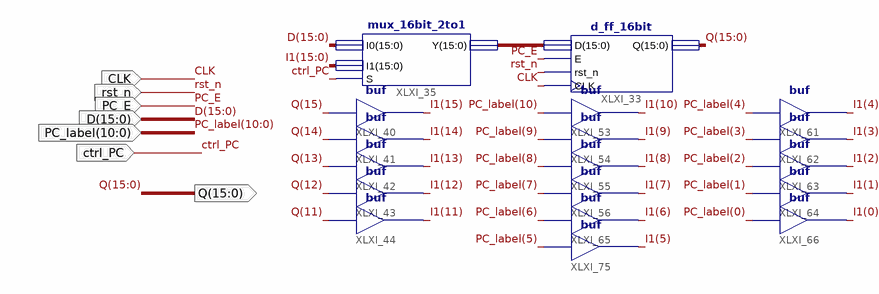
[diagram p0: schematic sheet 1]
// Xilinx ISE schematic PC_Circuit.sch (virtex6) as structural Verilog: 18 symbols, 7 ports
module PC_Circuit (
  input  rst_n,
  input  CLK,
  input  PC_E,
  input  [15:0] D,
  input  ctrl_PC,
  input  [10:0] PC_label,
  output [15:0] Q
);

  wire [15:0] I1, XLXN_159;

  mux_16bit_2to1 XLXI_35 (.S(ctrl_PC), .I1(I1), .I0(D), .Y(XLXN_159));
  d_ff_16bit XLXI_33 (.E(PC_E), .D(XLXN_159), .Q(Q), .CLK(CLK), .rst_n(rst_n));
  buf XLXI_40 (I1[15], Q[15]);
  buf XLXI_41 (I1[14], Q[14]);
  buf XLXI_42 (I1[13], Q[13]);
  buf XLXI_43 (I1[12], Q[12]);
  buf XLXI_44 (I1[11], Q[11]);
  buf XLXI_53 (I1[10], PC_label[10]);
  buf XLXI_54 (I1[9], PC_label[9]);
  buf XLXI_55 (I1[8], PC_label[8]);
  buf XLXI_56 (I1[7], PC_label[7]);
  buf XLXI_65 (I1[6], PC_label[6]);
  buf XLXI_75 (I1[5], PC_label[5]);
  buf XLXI_61 (I1[4], PC_label[4]);
  buf XLXI_62 (I1[3], PC_label[3]);
  buf XLXI_63 (I1[2], PC_label[2]);
  buf XLXI_64 (I1[1], PC_label[1]);
  buf XLXI_66 (I1[0], PC_label[0]);
endmodule
